# EasyEDA Pro project TASK1.eprj

# Schematic Schematic1
Board Name: Board1; Create Date: 2025-11-17; Page Name: P1; Project Name: TASK1; Schematic Name: Schematic1; Update Date: 2025-11-18; Company: 嘉立创EDA; Page Size: A4; Version: V1.0
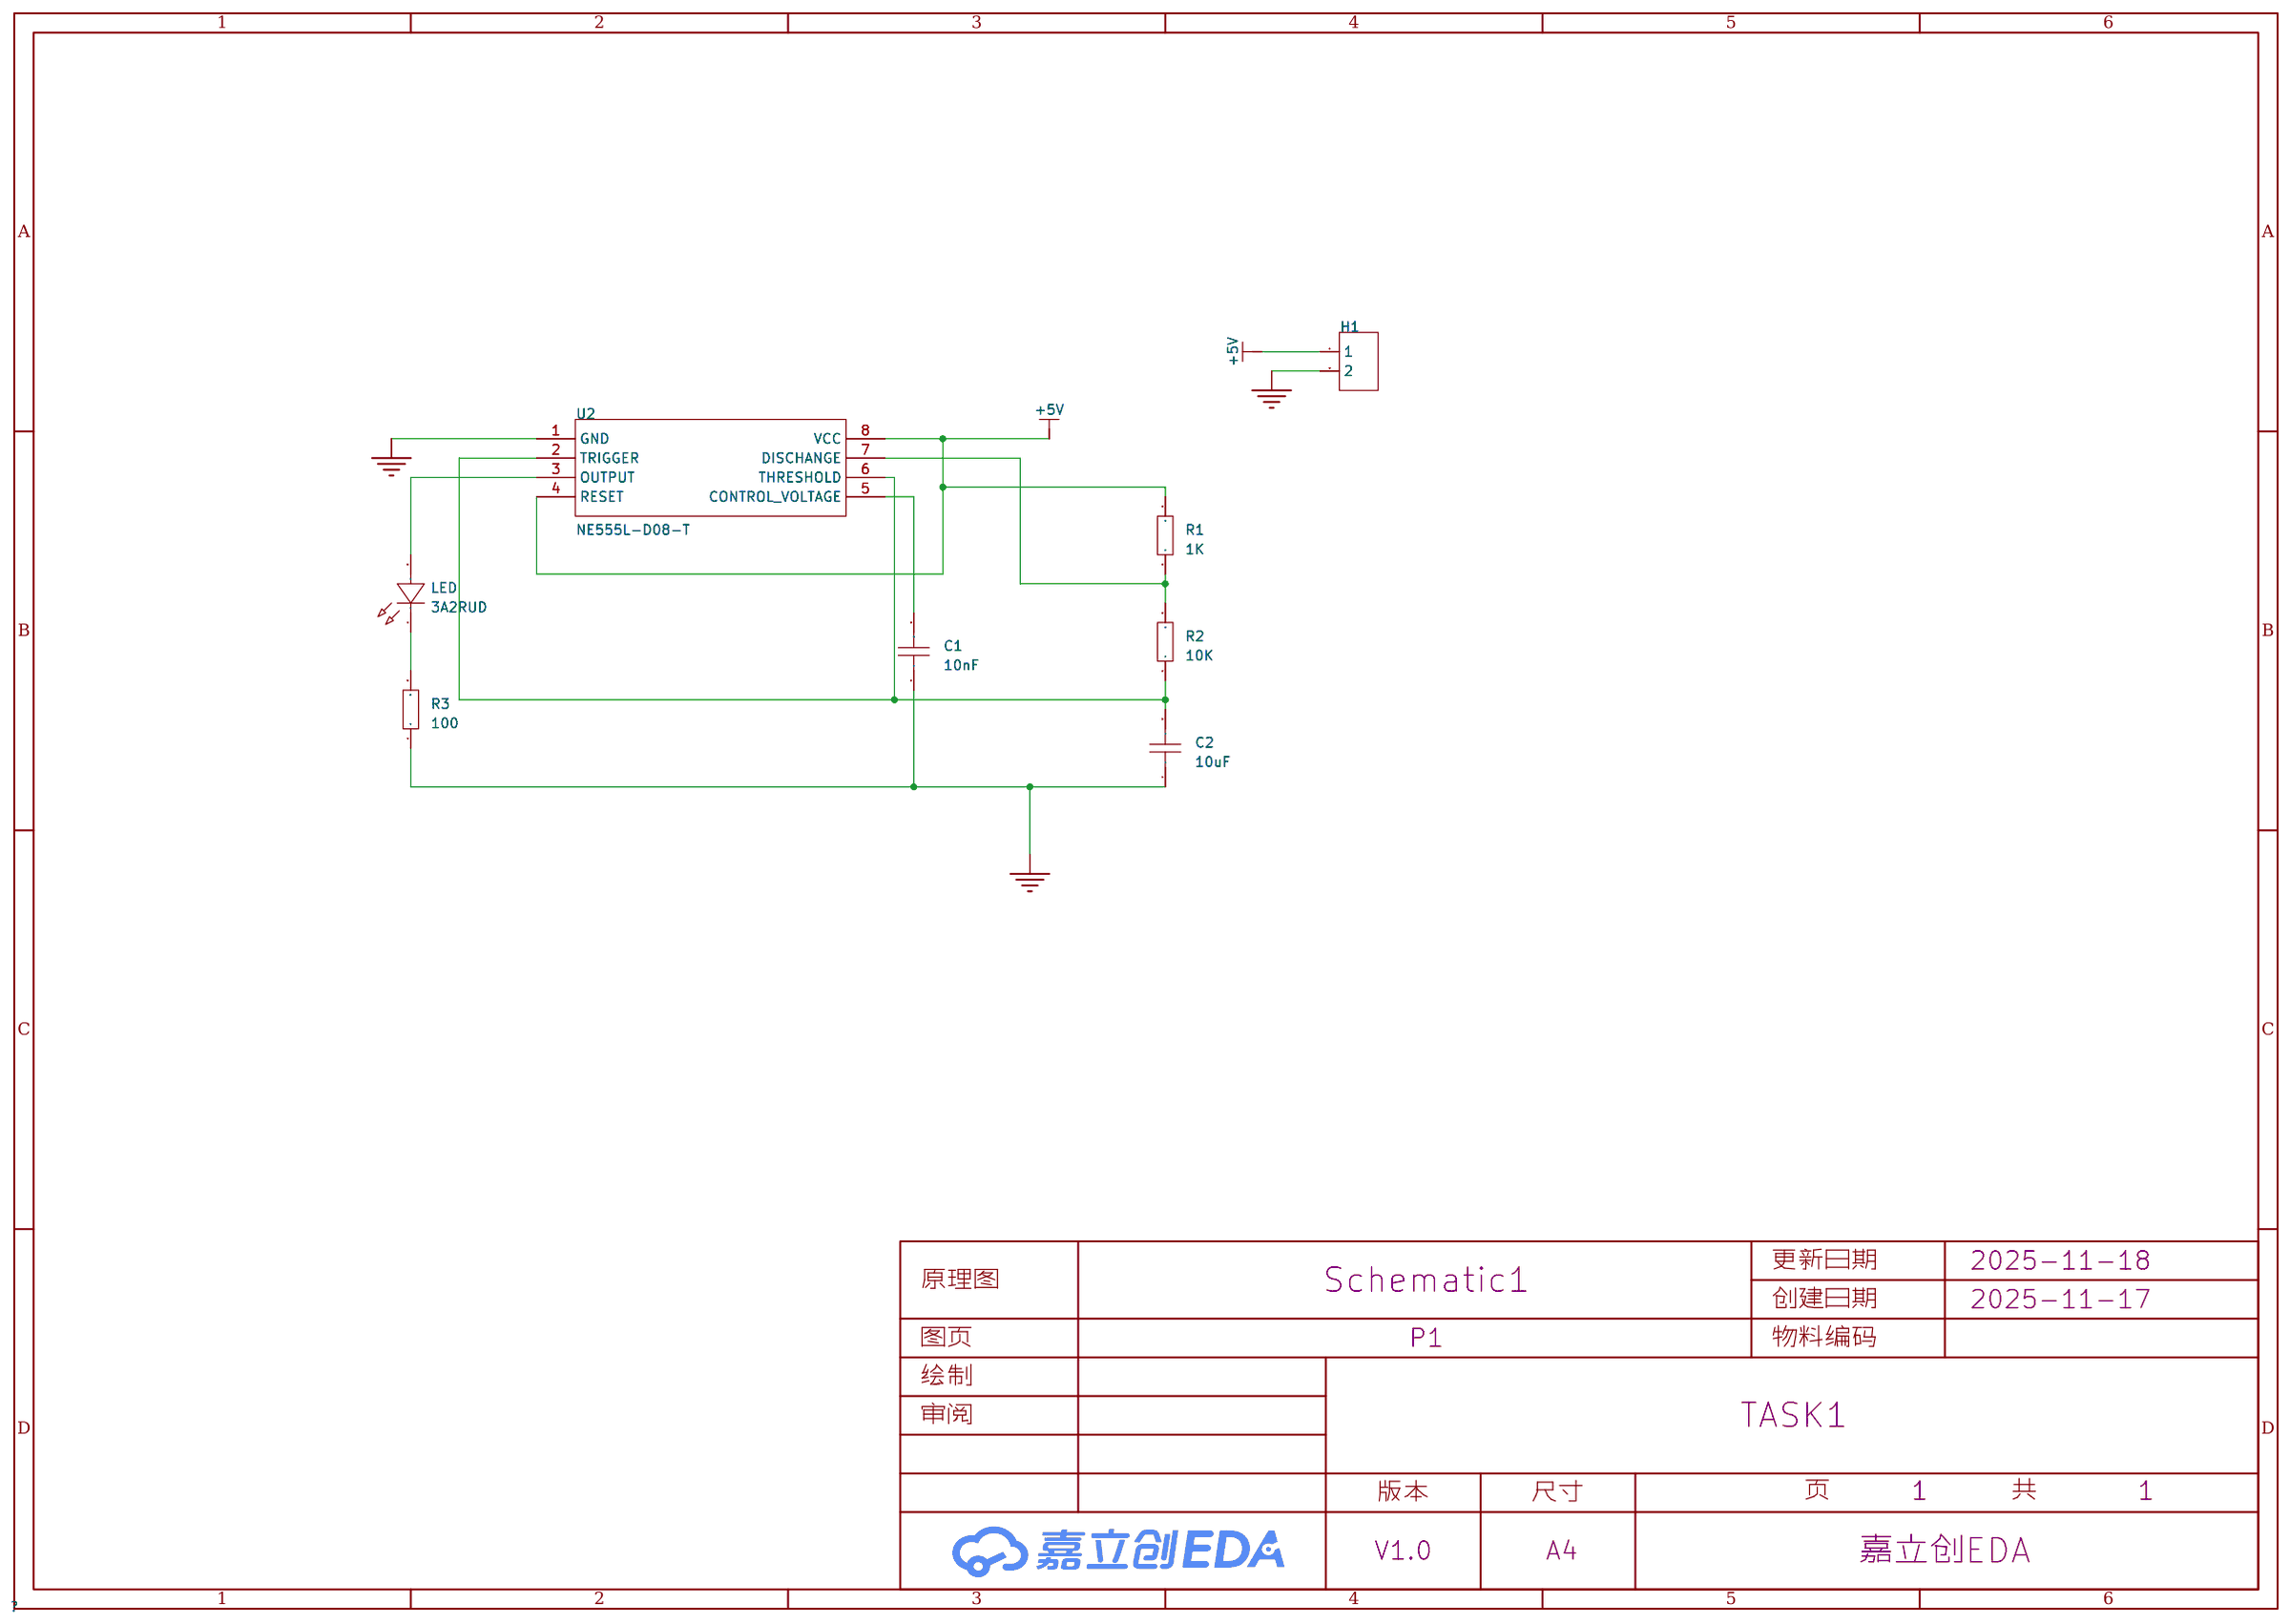
[diagram p0: schematic sheet]

## Parts
C1  10nF  [C0603]
C2  10uF  [C0603]
H1  -  [HDR-TH_2P-P2.54-V-F]
LED  3A2RUD  [LED-TH_BD3.5-P2.28_3A2RUC]
R1  1K  [R0603]
R2  10K  [R0603]
R3  100  [R0603]
U2  NE555L-D08-T  [DIP-8_L9.2-W6.4-P2.54-LS8.7-BL]

## Library data of the parts
C1 C2 = CAP_0603: Supplier Footprint: 0603
H1 = HDR-F_2.54_1x2P: Supplier Part: C49661; Supplier Footprint: 插件
LED = 3A2RUD: LCSC Part Name: 3mm 红发红短脚; Supplier Part: C52034637; Manufacturer: Guiguang light(桂光光电); Supplier Footprint: 插件,D=3mm; JLCPCB Part Class: 扩展库; Datasheet: https://item.szlcsc.com/datasheet/3A2RUD/54791005.html; Supplier: LCSC; Lamp Holder Type: 3mm圆形灯头; Illumination Color: 红色; Voltage - Forward(Vf): 1.8V~2.2V; Forward Current: 20mA; Wavelength - Dominant: 620nm~625nm; Peak Wavelength: 625nm; Lens Color: 红色透镜; Luminous Intensity: 200mcd~400mcd; Viewing Angle: 30°; Operating Temperature: -40℃~+85℃
R1-R3 = Res_0603: Supplier Footprint: 0603
U2 = NE555L-D08-T: Supplier Part: C114801; Manufacturer: UTC(友顺); Supplier Footprint: DIP-8; JLCPCB Part Class: Extended Part; Datasheet: https://atta.szlcsc.com/upload/public/pdf/source/20170912/C114801_1505207821534963484.pdf; Supplier: LCSC

## Nets
+5V: H1.1 R1.2 U2.4(RESET) U2.8(VCC)
GND: C1.1 C2.1 H1.2 R3.1 U2.1(GND)
$1N687: R1.1 R2.2 U2.7(DISCHANGE)
$1N853: C1.2 U2.5(CONTROL VOLTAGE)
$1N860: C2.2 R2.1 U2.2(TRIGGER) U2.6(THRESHOLD)
$1N977: LED.2(A) U2.3(OUTPUT)
$1N982: LED.1(K) R3.2

# Board PCB1
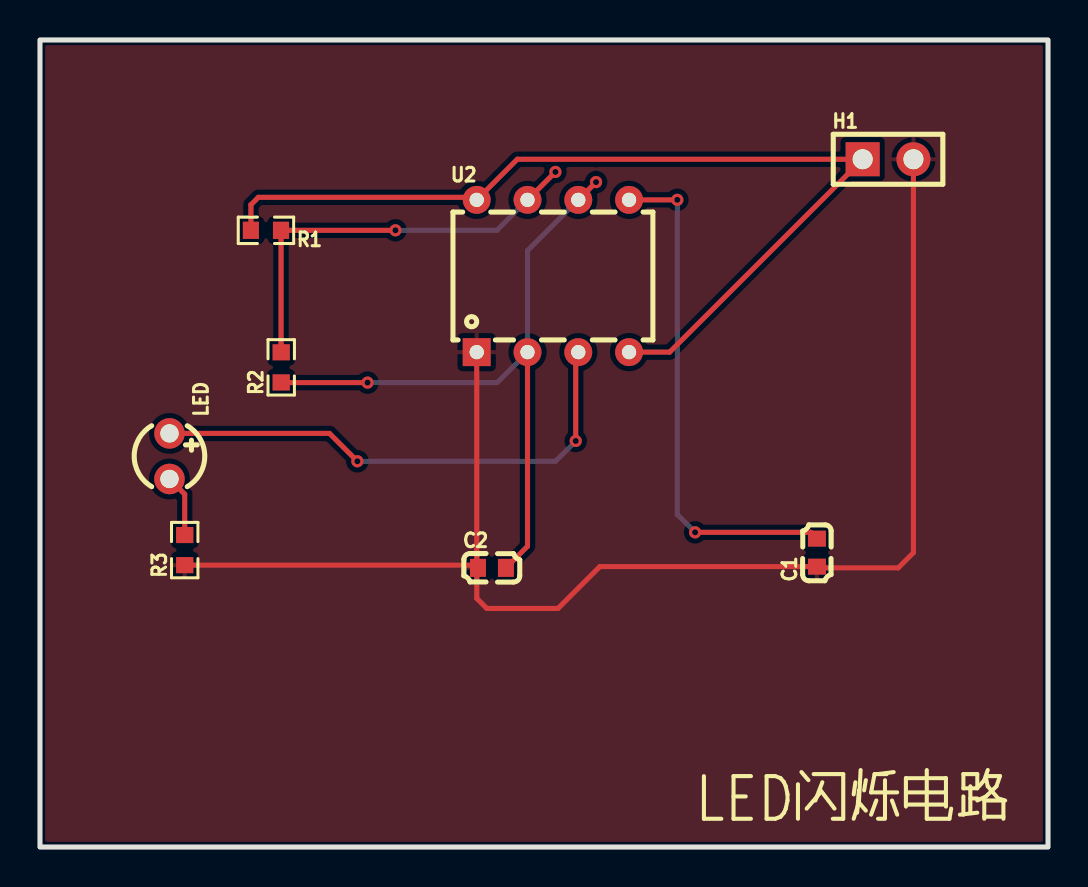
[diagram p1: board, top side]
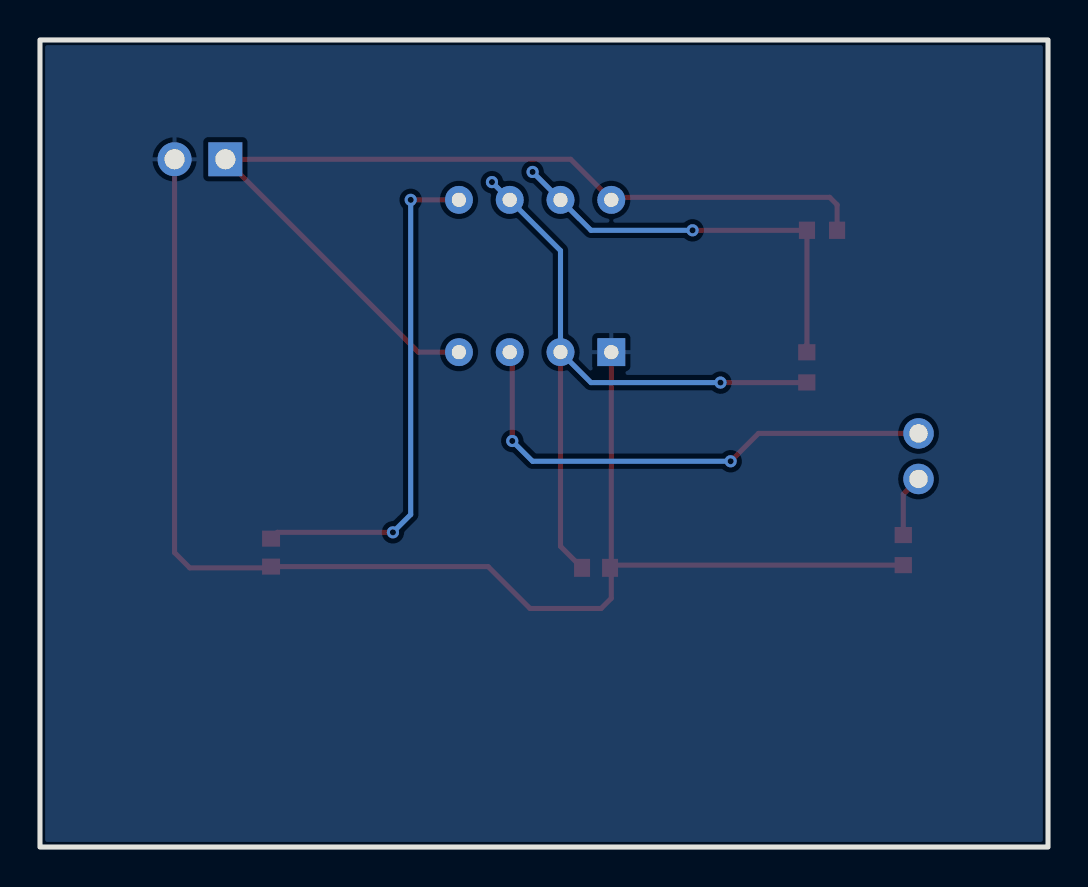
[diagram p2: board, bottom side, seen from below]

Outline 50.42 x 40.39 mm; copper layers: Top Layer, Bottom Layer. Coordinates in mm from the lower left corner of the outline.
Outline path: rectangle 0,40.39 50.42,0
Stack: Top Layer 0.035mm / Dielectric1 1.51mm FR4 er 4.5 / Bottom Layer 0.035mm

## Design rules (mm)
template: JLCPCB Capability(Two Layers Board)
spacing copperThickness1oz (default): track to track 0.102, other pairs 0.152 to 0.3
spacing copperThickness2oz: track to track 0.203, other pairs 0.152 to 0.3
track width copperThickness1oz (default): min 0.127, default 0.254, max 2.54
track width copperThickness2oz: min 0.203, default 0.254, max 2.54
differential pair differentialPair (default): width min 0.127, default 0.254, max 2.54; gap min 0.152, default 0.152
via viaSize (default): diameter min 0.5, default 0.61, max 10; hole min 0.3, default 0.305, max 6.3

## Placement (name value [footprint] x y rotation side)
C1  10nF  [C0603]  38.86 14.73 90 top
C2  10uF  [C0603]  22.61 13.97 0 top
H1  -  [HDR-TH_2P-P2.54-V-F]  42.42 34.42 0 top
LED  3A2RUD  [LED-TH_BD3.5-P2.28_3A2RUC]  6.48 19.56 270 top
R1  1K  [R0603]  11.3 30.86 180 top
R2  10K  [R0603]  12.06 24 90 top
R3  100  [R0603]  7.24 14.86 90 top
U2  NE555L-D08-T  [DIP-8_L9.2-W6.4-P2.54-LS8.7-BL]  25.65 28.57 0 top

## Footprints (pads in the part's own frame, mm; a bottom-side part is the same pattern mirrored in y, then rotated)
C0603
  rect 0.8x0.9 smd: 1(-0.7,0) 2(0.7,0)
DIP-8_L9.2-W6.4-P2.54-LS8.7-BL
  rect 1.397x1.397 hole 0.711: 1(-3.81,-3.81)
  round 1.397 hole 0.711: 2(-1.27,-3.81) 3(1.27,-3.81) 4(3.81,-3.81) 5(3.81,3.81) 6(1.27,3.81) 7(-1.27,3.81) 8(-3.81,3.81)
HDR-TH_2P-P2.54-V-F
  rect 1.7x1.7 hole 1: 1(-1.27,0)
  round 1.7 hole 1: 2(1.27,0)
LED-TH_BD3.5-P2.28_3A2RUC
  round 1.524 hole 0.914: 1(1.14,0) 2(-1.14,0)
R0603
  rect 0.806x0.864 smd: 1(-0.753,0) 2(0.753,0)

## Nets
As in the schematic.

## Via types
v1: diameter 0.61, hole 0.305, Top Layer to Bottom Layer, 8 vias

## Routing (per net, layer and track width the routed paths; a pad name or vN(x,y) marks a point on that pad's centre or on a via; arc(x,y) is an arc through that point)
+5V: length 48.6
  Top Layer w0.254: R1.2 10.55,32.14 10.92,32.51 21.72,32.51 U2.8 23.88,34.42 H1.1 31.5,24.77 29.46,24.77
GND: length 69.9
  Top Layer w0.254: H1.2 43.69,14.73 42.93,13.97 38.92,13.97 C1.1 28,14.03 25.91,11.94 22.35,11.94 21.84,12.45 21.84,13.91 C2.1 ; 21.84,24.77 21.84,14.03 21.77,14.11 R3.1
$1N687: length 22.8
  Top Layer w0.254: U2.7 v1(25.78,33.78) ; v1(17.78,30.86) R1.1 12.06,25.15 12.18,25.02
  Bottom Layer w0.254: v1(17.78,30.86) 22.86,30.86 U2.7 v1(25.78,33.78)
$1N853: length 25.6
  Top Layer w0.254: C1.2 38.55,15.75 v1(32.77,15.75) ; U2.5 v1(31.88,32.38)
  Bottom Layer w0.254: v1(31.88,32.38) 31.88,16.64 v1(32.77,15.75)
$1N860: length 35.4
  Top Layer w0.254: C2.2 24.38,15.05 24.38,24.77 ; R2.1 12.07,23.24 v1(16.38,23.24) ; U2.6 v1(27.81,33.27)
  Bottom Layer w0.254: v1(16.38,23.24) 22.86,23.24 24.38,24.77 24.38,29.84 U2.6 v1(27.81,33.27)
$1N977: length 25.8
  Top Layer w0.254: 26.92,24.77 26.8,24.64 v1(26.8,20.32) ; v1(15.88,19.3) 14.48,20.7 LED.2
  Bottom Layer w0.254: v1(15.88,19.3) 25.78,19.3 v1(26.8,20.32)
$1N982: length 3.1
  Top Layer w0.254: LED.1 7.24,17.66 R3.2

## Copper pours and planes (outline as drawn; the poured copper is in the pictures)
GND on Top Layer: 0,40.39 50.42,40.39 50.42,0 0,0
GND on Bottom Layer: 0,40.39 50.42,40.39 50.42,0 0,0

## Text on the board
Top Silkscreen Layer: LED闪烁电路
